# Altium schematic sheet Column.SchDoc
size A4; SheetNumber: 4; SheetTotal: 5
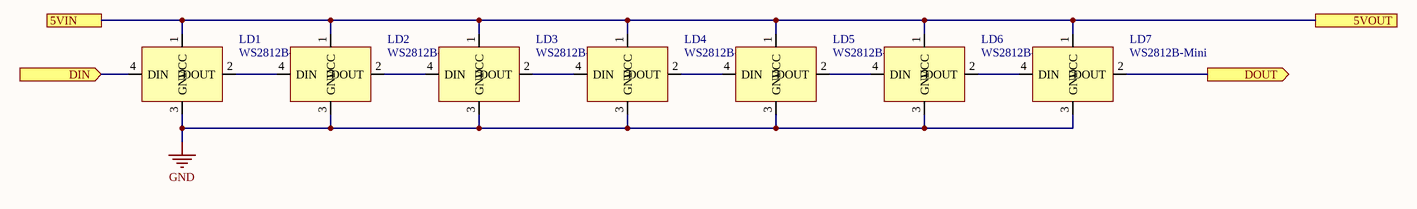
[diagram p0: Column.SchDoc]

## Parts
LD1  WS2812B-Mini  [WS2812B-Mini]
LD2  WS2812B-Mini  [WS2812B-Mini]
LD3  WS2812B-Mini  [WS2812B-Mini]
LD4  WS2812B-Mini  [WS2812B-Mini]
LD5  WS2812B-Mini  [WS2812B-Mini]
LD6  WS2812B-Mini  [WS2812B-Mini]
LD7  WS2812B-Mini  [WS2812B-Mini]

## Ports
5VIN, 5VOUT, DIN (in), DOUT (out)

## Nets
GND: LD1.3(GND) LD2.3(GND) LD3.3(GND) LD4.3(GND) LD5.3(GND) LD6.3(GND) LD7.3(GND)
5VIN: LD1.1(VCC) LD2.1(VCC) LD3.1(VCC) LD4.1(VCC) LD5.1(VCC) LD6.1(VCC) LD7.1(VCC) ; port 5VIN, port 5VOUT
DIN: LD1.4(DIN) ; port DIN
DOUT: LD7.2(DOUT) ; port DOUT
NetLD1_2: LD1.2(DOUT) LD2.4(DIN)
NetLD2_2: LD2.2(DOUT) LD3.4(DIN)
NetLD3_2: LD3.2(DOUT) LD4.4(DIN)
NetLD4_2: LD4.2(DOUT) LD5.4(DIN)
NetLD5_2: LD5.2(DOUT) LD6.4(DIN)
NetLD6_2: LD6.2(DOUT) LD7.4(DIN)

## Library data of the parts
LD1-LD7 = WS2812: C114583